# EAGLE design domino4_EPA (EAGLE 9.6.2)
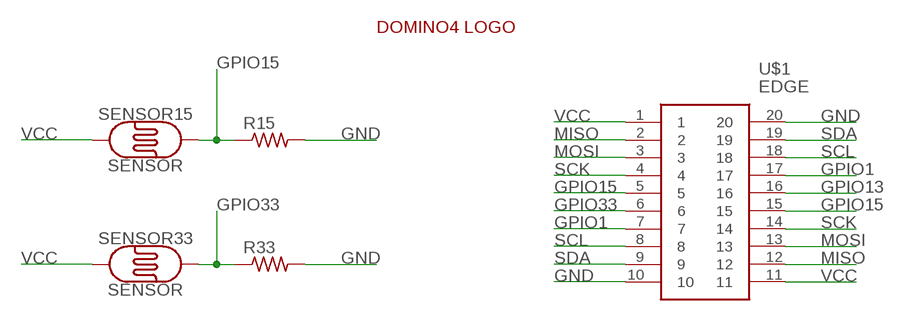
[diagram p0: schematic, sheet 1]

## Parts
R15  R-US_FLIPFLOP  [0805-THM]
R33  R-US_FLIPFLOP  [0805-THM]
SENSOR15  SENSOR  PHOTOCELLPTH-KIT  [PHOTOCELL-KIT]
SENSOR33  SENSOR  PHOTOCELLPTH-KIT  [PHOTOCELL-KIT]
U$1  EDGE  [EDGE]
U$5  DOMINO4_LOGO  [DOMINO4_LOGO]

## Nets
GND: R15.2 R33.2 U$1.10 U$1.20
GPIO1: U$1.7 U$1.17
GPIO13: U$1.16
GPIO15: R15.1 SENSOR15.2 U$1.5 U$1.15
GPIO33: R33.1 SENSOR33.2 U$1.6
MISO: U$1.2 U$1.12
MOSI: U$1.3 U$1.13
SCK: U$1.4 U$1.14
SCL: U$1.8 U$1.18
SDA: U$1.9 U$1.19
VCC: SENSOR15.1 SENSOR33.1 U$1.1 U$1.11

## Library data of the parts
R15 R33 = adafruit:R-US_: RESISTOR, American symbol
SENSOR15 SENSOR33 = SparkFun-Sensors:PHOTOCELL: Photocell (Photodetector, Photo Resistor, CdS) This is a very small light sensor. A photocell changes (also called a photodetector, photo resistor, CdS or photoconductive cell) resistance depending on the amount of light it is exposed to. These little sensors make great ambient light triggers (when light in the room turns on, do something). Datasheet <http://cdn.sparkfun.com/datasheets/Sensors/LightImaging/SEN-09088.pdf> SparkFun Products Mini Photocell <https://www.sparkfun.com/products/9088> (SEN-09088); PROD_ID: COMP-09129; SF_ID: SEN-09088
U$1 = 47030-00J191:EDGE
U$5 = 24mm:DOMINO4_LOGO

## Board
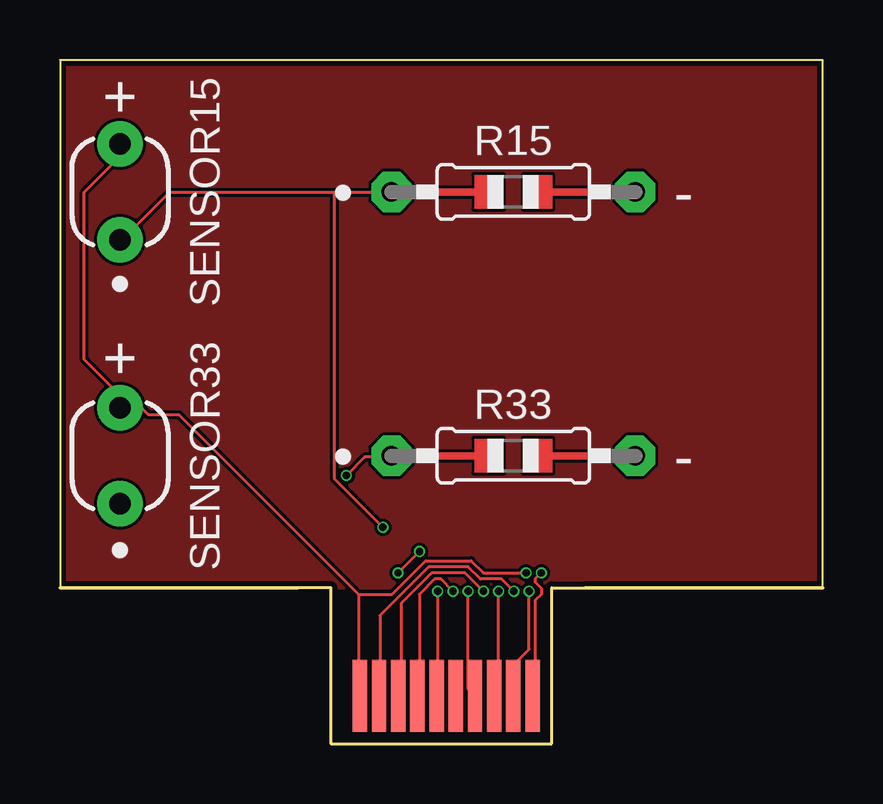
[diagram p1: board, top side]
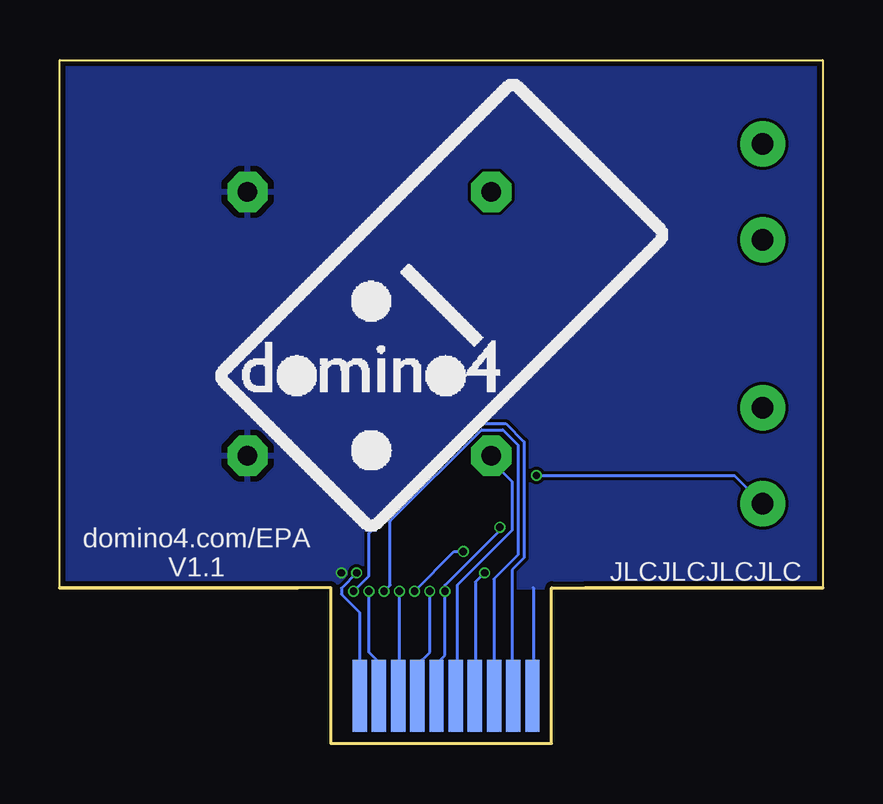
[diagram p2: board, bottom side, seen from below]

Size 31.8 x 28.5 mm. Coordinates in mm from the lower left corner, seen from the top.
Outline: 9.9,6.5 0,6.5 0,28.5 31.8,28.5 31.8,6.5 21.9,6.5
Copper layers (1*16): Top 0.035559375mm / dielectric 1.6mm / Bottom 0.035559375mm
Design rules "jlcpcb2layer": minimum track width 5mil, minimum drill 12mil, track to track 5mil, track to pad 5mil, pad to pad 5mil, via to via 5mil, smd to smd 5mil, copper to edge 8mil, drill to drill 6mil, minimum pad ring 5mil, minimum via ring 3mil, stop-mask expansion 2.5mil, vias tented up to drill 0mil, thermal gap 10mil

### Footprints (pad centres in the part's own frame; a part is rotated, then mirrored left to right if it is on the bottom)
0805-THM = drill 0.813 pad 1.676 octagon: 1 -5.08,0; 2 5.08,0
PHOTOCELL-KIT = drill 0.9 pad 1.88: 1 -2,0; 2 2,0
EDGE = smd 0.6 x 3 bottom: 1 3.4,2; 2 2.6,2; 3 1.8,2; 4 1,2; 5 0.2,2; 6 -0.6,2; 7 -1.4,2; 8 -2.2,2; 9 -3,2; 10 -3.8,2 | smd 0.6 x 3: 11 -3.4,2; 12 -2.6,2; 13 -1.8,2; 14 -1,2; 15 -0.2,2; 16 0.6,2; 17 1.4,2; 18 2.2,2; 19 3,2; 20 3.8,2

### Placement (x,y rotation side)
R15  18.9,23 0 top
R33  18.9,12 0 top
SENSOR15  2.5,23 270 top
SENSOR33  2.5,12 270 top
U$1  15.9,0 0 top
U$3  [JLCPCB-ORDER-NO]  4.88,7.18 0 bottom
U$5  15.9,18.3 0 bottom

### Tracks (layer width: path | path; a pad name or v marks a point on that pad's centre or on a via)
GND  (via drill 0.3)
  Top 0.127: v20.07,7.11 19.81,6.86 19.81,6.73 20.07,6.48 20.07,6.22 19.81,5.97 19.81,2.03 U$1.20
  Bottom 0.127: 12.06,6.5 12.06,2.03 U$1.10
  pour Bottom: 0,28.5 31.8,28.5 31.8,6.5 0,6.5
GND1
  pour Top: 0,28.5 31.8,28.5 31.8,6.5 0,6.5
GPIO1  (via drill 0.3)
  Top 0.127: v14.99,8 v14.1,7.11 | v17.02,6.35 17.02,2.29 17.27,2.03 U$1.17
  Bottom 0.127: v14.1,7.11 14.48,6.73 14.48,2.03 U$1.7 | v14.99,8 15.37,8 v17.02,6.35
GPIO15  (via drill 0.3)
  Top 0.127: v15.75,6.35 15.75,2.03 U$1.15 | 11.43,22.99 4.57,22.99 2.54,20.95 SENSOR15.2 | 11.43,22.99 13.72,22.99 R15.1 | v13.46,9.02 11.43,11.05 11.43,22.99
  Bottom 0.127: U$1.5 16,2.03 16,3.43 15.75,3.68 v15.75,6.35 15.75,6.6 13.46,8.89 v13.46,9.02
GPIO33  (via drill 0.3)
  Top 0.127: v11.94,11.18 12.7,11.94 13.72,11.94 R33.1
  Bottom 0.127: U$1.6 15.24,2.03 15.24,6.6 12.95,8.89 12.95,10.92 13.72,11.68 13.72,11.94 R33.1 | v11.94,11.18 3.68,11.18 2.54,10.03 SENSOR33.2
MISO  (via drill 0.3)
  Top 0.127: v18.92,6.35 18.41,6.86 17.53,6.86 17.02,7.37 15.37,7.37 13.34,5.33 13.34,2.03 U$1.12
  Bottom 0.127: v18.92,6.35 18.92,3.81 18.54,3.43 18.54,2.03 U$1.2
MOSI  (via drill 0.3)
  Top 0.127: v17.65,6.35 16.89,7.11 15.49,7.11 14.22,5.84 14.22,2.03 U$1.13
  Bottom 0.127: v17.65,6.35 17.65,2.03 U$1.3
SCK  (via drill 0.3)
  Top 0.127: v16.38,6.35 15.88,6.86 15.62,6.86 14.99,6.22 14.99,2.03 U$1.14
  Bottom 0.127: v16.38,6.35 16.38,3.81 16.89,3.3 16.89,2.03 U$1.4
SCL  (via drill 0.3)
  Top 0.127: v18.29,6.35 18.29,2.16 18.16,2.03 U$1.18
  Bottom 0.127: v18.29,6.35 18.03,6.6 18.03,9.27 14.22,13.08 13.34,13.08 12.7,12.45 12.7,7.87 13.72,6.86 13.72,2.03 U$1.8
SDA  (via drill 0.3)
  Top 0.127: v19.56,6.35 19.56,3.94 18.92,3.3 18.92,2.03 U$1.19
  Bottom 0.127: v19.56,6.35 18.92,6.99 18.92,8.76 14.35,13.34 13.21,13.34 12.45,12.57 12.45,7.75 12.95,7.24 12.95,2.03 U$1.9
VCC  (via drill 0.3)
  Top 0.127: 12.45,6.22 12.45,2.03 U$1.11 | 12.45,6.22 4.95,13.72 3.68,13.72 3.43,13.97 2.54,13.97 SENSOR33.1 2.41,14.1 2.41,14.61 1.02,16 1.02,22.99 2.41,24.38 2.41,24.89 SENSOR15.1 | v19.43,7.11 17.65,7.11 17.14,7.62 15.24,7.62 13.84,6.22 12.45,6.22
  Bottom 0.127: v19.43,7.11 20.07,6.48 20.07,6.22 19.3,5.46 19.3,2.03 U$1.1

### Text on the board
tPlace: + | • | - | • | + | • | - | •
bPlace: domino4.com/EPA / V1.1